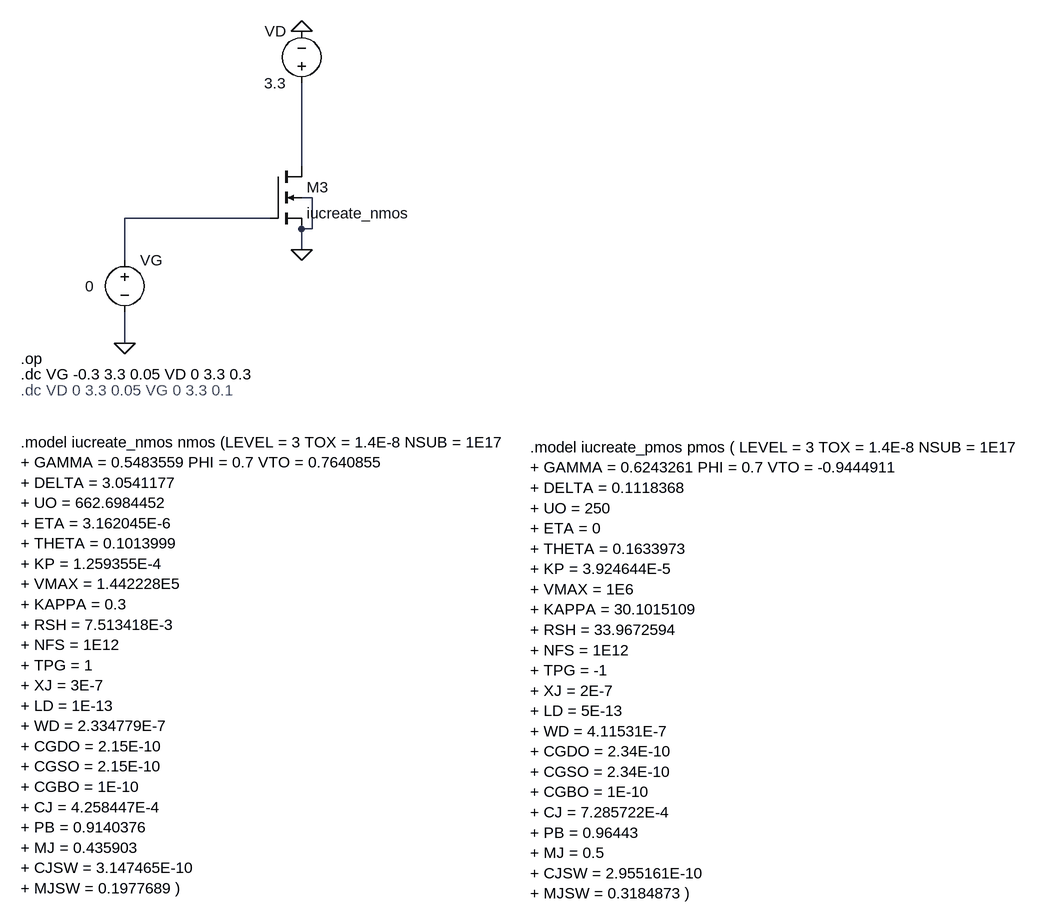
[diagram p0: schematic see_hw_p0.asc]
see_hw_p0.asc, the LTspice schematic file:
Version 4
SHEET 1 2536 1352
WIRE 432 272 432 144
WIRE 448 320 432 320
WIRE 384 352 160 352
WIRE 448 368 448 320
WIRE 448 368 432 368
WIRE 432 400 432 368
WIRE 160 416 160 352
WIRE 160 544 160 496
FLAG 432 64 0
FLAG 432 400 0
FLAG 160 544 0
SYMBOL voltage 432 160 R180
WINDOW 0 24 96 Left 2
WINDOW 3 24 16 Left 2
SYMATTR InstName VD
SYMATTR Value 3.3
SYMBOL voltage 160 400 R0
WINDOW 3 -47 56 Right 2
SYMATTR Value 0
SYMATTR InstName VG
SYMATTR Value2 AC 1
SYMBOL nmos4 384 272 R0
SYMATTR InstName M3
SYMATTR Value iucreate_nmos
SYMATTR Value2 l=0.5u w=1.5u
TEXT 0 568 Left 2 !.op
TEXT 0 592 Left 2 !.dc VG -0.3 3.3 0.05 VD 0 3.3 0.3
TEXT 0 696 Left 2 !.model iucreate_nmos nmos (LEVEL = 3 TOX = 1.4E-8 NSUB = 1E17 \n+ GAMMA = 0.5483559 PHI = 0.7 VTO = 0.7640855\n+ DELTA = 3.0541177\n+ UO = 662.6984452\n+ ETA = 3.162045E-6\n+ THETA = 0.1013999\n+ KP = 1.259355E-4\n+ VMAX = 1.442228E5\n+ KAPPA = 0.3\n+ RSH = 7.513418E-3\n+ NFS = 1E12\n+ TPG = 1\n+ XJ = 3E-7\n+ LD = 1E-13\n+ WD = 2.334779E-7\n+ CGDO = 2.15E-10\n+ CGSO = 2.15E-10\n+ CGBO = 1E-10\n+ CJ = 4.258447E-4\n+ PB = 0.9140376\n+ MJ = 0.435903\n+ CJSW = 3.147465E-10\n+ MJSW = 0.1977689 )
TEXT 784 704 Left 2 !.model iucreate_pmos pmos ( LEVEL = 3 TOX = 1.4E-8 NSUB = 1E17\n+ GAMMA = 0.6243261 PHI = 0.7 VTO = -0.9444911\n+ DELTA = 0.1118368\n+ UO = 250\n+ ETA = 0\n+ THETA = 0.1633973\n+ KP = 3.924644E-5\n+ VMAX = 1E6\n+ KAPPA = 30.1015109\n+ RSH = 33.9672594\n+ NFS = 1E12\n+ TPG = -1\n+ XJ = 2E-7\n+ LD = 5E-13\n+ WD = 4.11531E-7\n+ CGDO = 2.34E-10\n+ CGSO = 2.34E-10\n+ CGBO = 1E-10\n+ CJ = 7.285722E-4\n+ PB = 0.96443\n+ MJ = 0.5\n+ CJSW = 2.955161E-10\n+ MJSW = 0.3184873 )
TEXT 0 616 Left 2 ;.dc VD 0 3.3 0.05 VG 0 3.3 0.1

The netlist it stands for:
* see_hw_p0.asc
VD N001 0 3.3
VG N002 0 0 AC 1
M3 N001 N002 0 0 iucreate_nmos l=0.5u w=1.5u
.model NMOS NMOS
.model PMOS PMOS
.lib standard.mos
.op
.dc VG -0.3 3.3 0.05 VD 0 3.3 0.3
.model iucreate_nmos nmos (LEVEL = 3 TOX = 1.4E-8 NSUB = 1E17
+ GAMMA = 0.5483559 PHI = 0.7 VTO = 0.7640855
+ DELTA = 3.0541177
+ UO = 662.6984452
+ ETA = 3.162045E-6
+ THETA = 0.1013999
+ KP = 1.259355E-4
+ VMAX = 1.442228E5
+ KAPPA = 0.3
+ RSH = 7.513418E-3
+ NFS = 1E12
+ TPG = 1
+ XJ = 3E-7
+ LD = 1E-13
+ WD = 2.334779E-7
+ CGDO = 2.15E-10
+ CGSO = 2.15E-10
+ CGBO = 1E-10
+ CJ = 4.258447E-4
+ PB = 0.9140376
+ MJ = 0.435903
+ CJSW = 3.147465E-10
+ MJSW = 0.1977689 )
.model iucreate_pmos pmos ( LEVEL = 3 TOX = 1.4E-8 NSUB = 1E17
+ GAMMA = 0.6243261 PHI = 0.7 VTO = -0.9444911
+ DELTA = 0.1118368
+ UO = 250
+ ETA = 0
+ THETA = 0.1633973
+ KP = 3.924644E-5
+ VMAX = 1E6
+ KAPPA = 30.1015109
+ RSH = 33.9672594
+ NFS = 1E12
+ TPG = -1
+ XJ = 2E-7
+ LD = 5E-13
+ WD = 4.11531E-7
+ CGDO = 2.34E-10
+ CGSO = 2.34E-10
+ CGBO = 1E-10
+ CJ = 7.285722E-4
+ PB = 0.96443
+ MJ = 0.5
+ CJSW = 2.955161E-10
+ MJSW = 0.3184873 )
* .dc VD 0 3.3 0.05 VG 0 3.3 0.1
.backanno
.end